# Altium schematic sheet 1_BLE-T1_top.SchDoc: waffling60 - PCB
size A4; Engineer: 4pplet; Revision: RevA; ProjectName: waffling60
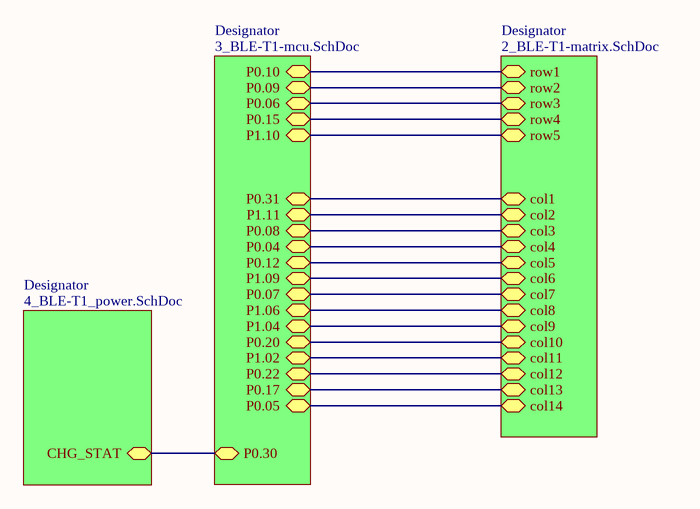
[diagram p0: 1_BLE-T1_top.SchDoc]

## Sub-sheets
Designator = 3_BLE-T1-mcu.SchDoc: P1.02, P1.04, P0.17, P0.09, P0.20, P1.06, P0.10, P0.22, P0.12, P0.15, P0.06, P1.09, P1.11, P0.08, P0.31, P0.04, P0.05, P1.10, P0.30, P0.07
Designator = 2_BLE-T1-matrix.SchDoc: col6, col8, col5, col7, col3, col2, col1, col4, col9, row3, row1, row4, row2, row5, col11, col10, col13, col14, col12
Designator = 4_BLE-T1_power.SchDoc: CHG_STAT

## Nets
(unnamed): sheet Designator/P1.02, sheet Designator/col11
(unnamed): sheet Designator/P1.04, sheet Designator/col9
(unnamed): sheet Designator/P0.17, sheet Designator/col13
(unnamed): sheet Designator/P0.09, sheet Designator/row2
(unnamed): sheet Designator/P0.20, sheet Designator/col10
(unnamed): sheet Designator/P1.06, sheet Designator/col8
(unnamed): sheet Designator/P0.10, sheet Designator/row1
(unnamed): sheet Designator/P0.22, sheet Designator/col12
(unnamed): sheet Designator/P0.12, sheet Designator/col5
(unnamed): sheet Designator/P0.15, sheet Designator/row4
(unnamed): sheet Designator/P0.06, sheet Designator/row3
(unnamed): sheet Designator/P1.09, sheet Designator/col6
(unnamed): sheet Designator/P1.11, sheet Designator/col2
(unnamed): sheet Designator/P0.08, sheet Designator/col3
(unnamed): sheet Designator/P0.31, sheet Designator/col1
(unnamed): sheet Designator/P0.04, sheet Designator/col4
(unnamed): sheet Designator/P0.05, sheet Designator/col14
(unnamed): sheet Designator/P1.10, sheet Designator/row5
(unnamed): sheet Designator/P0.30, sheet Designator/CHG_STAT
(unnamed): sheet Designator/P0.07, sheet Designator/col7